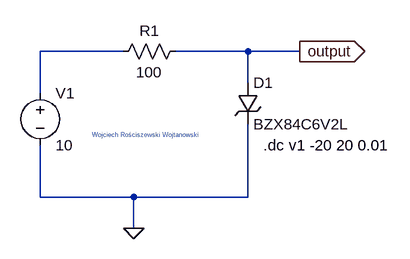
[diagram p0: schematic Characteristic of semiconductor diode.asc]
Characteristic of semiconductor diode.asc, the LTspice schematic file:
Version 4
SHEET 1 880 680
WIRE -224 -352 -352 -352
WIRE -32 -352 -144 -352
WIRE 48 -352 -32 -352
WIRE -32 -304 -32 -352
WIRE -352 -288 -352 -352
WIRE -352 -128 -352 -208
WIRE -208 -128 -352 -128
WIRE -32 -128 -32 -240
WIRE -32 -128 -208 -128
WIRE -208 -80 -208 -128
FLAG -208 -80 0
FLAG 48 -352 output
IOPIN 48 -352 Out
SYMBOL res -128 -368 R90
WINDOW 0 0 56 VBottom 2
WINDOW 3 32 56 VTop 2
SYMATTR InstName R1
SYMATTR Value 100
SYMBOL zener -48 -304 R0
SYMATTR InstName D1
SYMATTR Value BZX84C6V2L
SYMATTR Description Diode
SYMATTR Type diode
SYMBOL voltage -352 -304 R0
WINDOW 123 0 0 Left 0
WINDOW 39 0 0 Left 0
SYMATTR InstName V1
SYMATTR Value 10
TEXT -272 -224 Left 0 ;Wojciech Rościszewski Wojtanowski
TEXT -8 -208 Left 2 !.dc v1 -20 20 0.01

The netlist it stands for:
* Characteristic of semiconductor diode.asc
R1 output N001 100
D1 output 0 BZX84C6V2L
V1 N001 0 10
.model D D
.lib standard.dio
* Wojciech Rościszewski Wojtanowski
.dc v1 -20 20 0.01
.backanno
.end